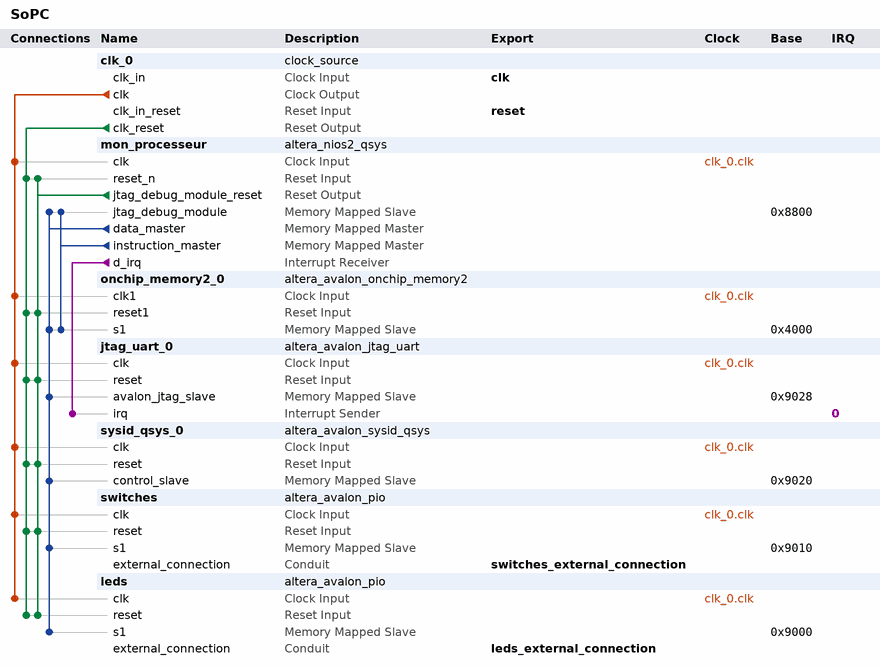
[diagram p0: system contents]
# Platform Designer (Qsys) system SoPC, Cyclone II EP2C20F484C7
# Parameters at their usual value, and those the tool derives, are not listed.
package require -exact qsys 13.0.1.99.2
create_system SoPC
set_project_property DEVICE_FAMILY {Cyclone II}
set_project_property DEVICE EP2C20F484C7

add_instance clk_0 clock_source 13.0
set_instance_parameter_value clk_0 clockFrequency 50000000

add_instance mon_processeur altera_nios2_qsys 13.0
set_instance_parameter_value mon_processeur resetSlave onchip_memory2_0.s1
set_instance_parameter_value mon_processeur mmu_TLBMissExcSlave None
set_instance_parameter_value mon_processeur exceptionSlave onchip_memory2_0.s1
set_instance_parameter_value mon_processeur breakSlave mon_processeur.jtag_debug_module
set_instance_parameter_value mon_processeur impl Tiny
set_instance_parameter_value mon_processeur icache_size 4096

add_instance onchip_memory2_0 altera_avalon_onchip_memory2 13.0.1.99.2
set_instance_parameter_value onchip_memory2_0 dataWidth 32
set_instance_parameter_value onchip_memory2_0 dualPort false
set_instance_parameter_value onchip_memory2_0 initMemContent true
set_instance_parameter_value onchip_memory2_0 initializationFileName onchip_mem.hex
set_instance_parameter_value onchip_memory2_0 memorySize 10240

add_instance jtag_uart_0 altera_avalon_jtag_uart 13.0.1.99.2
set_instance_parameter_value jtag_uart_0 simInteractiveOptions NO_INTERACTIVE_WINDOWS

add_instance sysid_qsys_0 altera_avalon_sysid_qsys 13.0
set_instance_parameter_value sysid_qsys_0 id 0

add_instance switches altera_avalon_pio 13.0.1.99.2
set_instance_parameter_value switches direction Input
set_instance_parameter_value switches width 8

add_instance leds altera_avalon_pio 13.0.1.99.2
set_instance_parameter_value leds direction Output
set_instance_parameter_value leds width 8

# connections
add_connection clk_0.clk jtag_uart_0.clk clock
add_connection clk_0.clk leds.clk clock
add_connection clk_0.clk mon_processeur.clk clock
add_connection clk_0.clk onchip_memory2_0.clk1 clock
add_connection clk_0.clk switches.clk clock
add_connection clk_0.clk sysid_qsys_0.clk clock
add_connection clk_0.clk_reset jtag_uart_0.reset reset
add_connection clk_0.clk_reset leds.reset reset
add_connection clk_0.clk_reset mon_processeur.reset_n reset
add_connection clk_0.clk_reset onchip_memory2_0.reset1 reset
add_connection clk_0.clk_reset switches.reset reset
add_connection clk_0.clk_reset sysid_qsys_0.reset reset
add_connection mon_processeur.jtag_debug_module_reset jtag_uart_0.reset reset
add_connection mon_processeur.jtag_debug_module_reset leds.reset reset
add_connection mon_processeur.jtag_debug_module_reset mon_processeur.reset_n reset
add_connection mon_processeur.jtag_debug_module_reset onchip_memory2_0.reset1 reset
add_connection mon_processeur.jtag_debug_module_reset switches.reset reset
add_connection mon_processeur.jtag_debug_module_reset sysid_qsys_0.reset reset
add_connection mon_processeur.data_master jtag_uart_0.avalon_jtag_slave avalon
set_connection_parameter_value mon_processeur.data_master/jtag_uart_0.avalon_jtag_slave baseAddress 0x9028
add_connection mon_processeur.data_master leds.s1 avalon
set_connection_parameter_value mon_processeur.data_master/leds.s1 baseAddress 0x9000
add_connection mon_processeur.data_master mon_processeur.jtag_debug_module avalon
set_connection_parameter_value mon_processeur.data_master/mon_processeur.jtag_debug_module baseAddress 0x8800
add_connection mon_processeur.data_master onchip_memory2_0.s1 avalon
set_connection_parameter_value mon_processeur.data_master/onchip_memory2_0.s1 baseAddress 0x4000
add_connection mon_processeur.data_master switches.s1 avalon
set_connection_parameter_value mon_processeur.data_master/switches.s1 baseAddress 0x9010
add_connection mon_processeur.data_master sysid_qsys_0.control_slave avalon
set_connection_parameter_value mon_processeur.data_master/sysid_qsys_0.control_slave baseAddress 0x9020
add_connection mon_processeur.instruction_master mon_processeur.jtag_debug_module avalon
set_connection_parameter_value mon_processeur.instruction_master/mon_processeur.jtag_debug_module baseAddress 0x8800
add_connection mon_processeur.instruction_master onchip_memory2_0.s1 avalon
set_connection_parameter_value mon_processeur.instruction_master/onchip_memory2_0.s1 baseAddress 0x4000
add_connection mon_processeur.d_irq jtag_uart_0.irq interrupt
set_connection_parameter_value mon_processeur.d_irq/jtag_uart_0.irq irqNumber 0

# exported interfaces
add_interface clk clock sink
set_interface_property clk EXPORT_OF clk_0.clk_in
add_interface reset reset sink
set_interface_property reset EXPORT_OF clk_0.clk_in_reset
add_interface switches_external_connection conduit end
set_interface_property switches_external_connection EXPORT_OF switches.external_connection
add_interface leds_external_connection conduit end
set_interface_property leds_external_connection EXPORT_OF leds.external_connection

set_interconnect_requirement {$system} qsys_mm.clockCrossingAdapter HANDSHAKE
set_interconnect_requirement {$system} qsys_mm.maxAdditionalLatency 1

save_system SoPC.qsys
